# Altium project 520电机驱动模块工程.PrjPcb
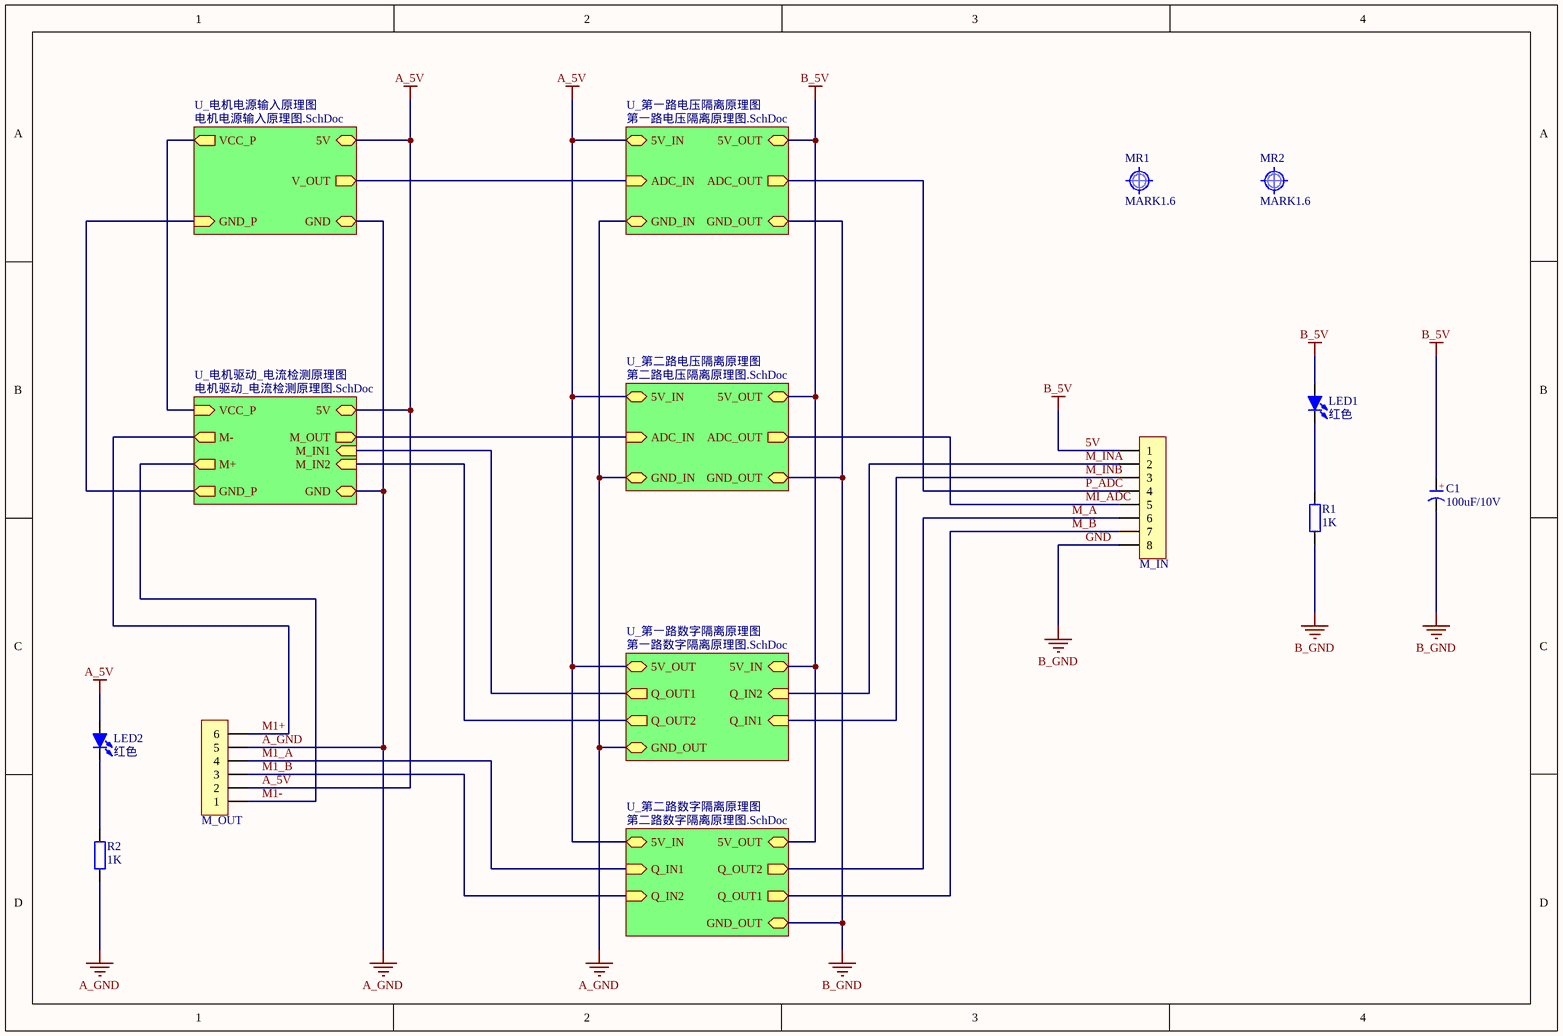
[diagram p0: 总原理框图.SchDoc]
6 sheets, 68 parts. Net scope: hierarchical (ports join the sheet entries above them; power ports are global).
Board file: PCB.PcbDoc
Sheets:
  总原理框图.SchDoc
    U_电机电源输入原理图 = 电机电源输入原理图.SchDoc
    U_第一路数字隔离原理图 = 第一路数字隔离原理图.SchDoc
    U_第一路电压隔离原理图 = 第一路电压隔离原理图.SchDoc
    U_第二路数字隔离原理图 = 第二路数字隔离原理图.SchDoc
    U_第二路电压隔离原理图 = 第二路电压隔离原理图.SchDoc

## Sheet 总原理框图.SchDoc
size A4

### Parts
C1  100uF/10V  [CD B(3528)]
LED1  红色  [LED 0603W]
LED2  红色  [LED 0603W]
M_IN  HDR-1X8  [ZH1.5-WI-8P]  (value not drawn)
M_OUT  HDR-1X6  [PH2.0-WI-6P]  (value not drawn)
MR1  MARK1.6  [Mark 1.6]
MR2  MARK1.6  [Mark 1.6]
R1  1K  [R 0603_M]
R2  1K  [R 0603_M]

### Sub-sheets
U_电机电源输入原理图 = 电机电源输入原理图.SchDoc: V_OUT (out), VCC_P (out), GND_P (in), 5V (bidir), GND (bidir)
U_电机驱动_电流检测原理图 = 电机驱动_电流检测原理图.SchDoc (file not in this document): 5V (bidir), VCC_P (in), GND_P (out), M+ (out), M- (out), GND (bidir), M_OUT (out), M_IN1 (in), M_IN2 (in)
U_第一路数字隔离原理图 = 第一路数字隔离原理图.SchDoc: 5V_IN (bidir), 5V_OUT (bidir), GND_OUT (bidir), Q_IN2 (in), Q_IN1 (in), Q_OUT1 (out), Q_OUT2 (out)
U_第一路电压隔离原理图 = 第一路电压隔离原理图.SchDoc: ADC_IN (in), ADC_OUT (out), 5V_IN (bidir), 5V_OUT (bidir), GND_IN (bidir), GND_OUT (bidir)
U_第二路数字隔离原理图 = 第二路数字隔离原理图.SchDoc: 5V_IN (bidir), 5V_OUT (bidir), GND_OUT (bidir), Q_IN2 (in), Q_IN1 (in), Q_OUT1 (out), Q_OUT2 (out)
U_第二路电压隔离原理图 = 第二路电压隔离原理图.SchDoc: ADC_IN (in), ADC_OUT (out), 5V_IN (bidir), 5V_OUT (bidir), GND_IN (bidir), GND_OUT (bidir)

### Nets
5V: C1.1(A) LED1.1(A) M_IN.1 ; sheet U_第一路数字隔离原理图/5V_IN, sheet U_第一路电压隔离原理图/5V_OUT, sheet U_第二路数字隔离原理图/5V_OUT, sheet U_第二路电压隔离原理图/5V_OUT  [also labelled B_5V]
A_5V: LED2.1(A) M_OUT.2 ; sheet U_电机电源输入原理图/5V, sheet U_电机驱动_电流检测原理图/5V, sheet U_第一路数字隔离原理图/5V_OUT, sheet U_第一路电压隔离原理图/5V_IN, sheet U_第二路数字隔离原理图/5V_IN, sheet U_第二路电压隔离原理图/5V_IN
A_GND: M_OUT.5 R2.1 ; sheet U_电机电源输入原理图/GND, sheet U_电机驱动_电流检测原理图/GND, sheet U_第一路数字隔离原理图/GND_OUT, sheet U_第一路电压隔离原理图/GND_IN, sheet U_第二路电压隔离原理图/GND_IN
GND: C1.2(K) M_IN.8 R1.1 ; sheet U_第一路电压隔离原理图/GND_OUT, sheet U_第二路数字隔离原理图/GND_OUT, sheet U_第二路电压隔离原理图/GND_OUT  [also labelled B_GND]
M1+: M_OUT.6 ; sheet U_电机驱动_电流检测原理图/M-
M1-: M_OUT.1 ; sheet U_电机驱动_电流检测原理图/M+
M1_A: M_OUT.4 ; sheet U_第二路数字隔离原理图/Q_IN1
M1_B: M_OUT.3 ; sheet U_第二路数字隔离原理图/Q_IN2
M_A: M_IN.6 ; sheet U_第二路数字隔离原理图/Q_OUT2
M_B: M_IN.7 ; sheet U_第二路数字隔离原理图/Q_OUT1
M_INA: M_IN.2 ; sheet U_第一路数字隔离原理图/Q_IN2
M_INB: M_IN.3 ; sheet U_第一路数字隔离原理图/Q_IN1
MI_ADC: M_IN.5 ; sheet U_第二路电压隔离原理图/ADC_OUT
P_ADC: M_IN.4 ; sheet U_第一路电压隔离原理图/ADC_OUT
NetC3_1: sheet U_电机电源输入原理图/VCC_P, sheet U_电机驱动_电流检测原理图/VCC_P
NetC3_2: sheet U_电机电源输入原理图/GND_P, sheet U_电机驱动_电流检测原理图/GND_P
NetLED1_2: LED1.2(K) R1.2
NetLED2_2: LED2.2(K) R2.2
NetR3_1: sheet U_电机电源输入原理图/V_OUT, sheet U_第一路电压隔离原理图/ADC_IN
NetR8_1: sheet U_电机驱动_电流检测原理图/M_IN1, sheet U_第一路数字隔离原理图/Q_OUT1
NetR9_1: sheet U_电机驱动_电流检测原理图/M_IN2, sheet U_第一路数字隔离原理图/Q_OUT2
NetR21_1: sheet U_电机驱动_电流检测原理图/M_OUT, sheet U_第二路电压隔离原理图/ADC_IN

### Notes on the sheet
- (in symbol C-CD) +

### Library data of the parts
C1 = C-CD: 贴片钽电容; 版权归属: 源创客; BOM名称: 贴片钽电容; 学习资源: www.ooocke.com
LED1 LED2 = LED-SMD: 贴片LED; 版权归属: 源创客; BOM名称: 贴片LED; 学习资源: www.ooocke.com
M_IN = Header 8: 8P接插件; 版权归属: 源创客; BOM名称: 8P接插件; 学习资源: www.ooocke.com
M_OUT = Header 6: 6P接插件; 版权归属: 源创客; BOM名称: 6P接插件; 学习资源: www.ooocke.com
MR1 MR2 = MARK: 光学定位点; 版权归属: 源创客; BOM名称: 光学定位点; 学习资源: www.ooocke.com
R1 R2 = R: 贴片电阻; 版权归属: 源创客; BOM名称: 贴片电阻; 学习资源: www.ooocke.com

## Sheet 电机电源输入原理图.SchDoc
size A4
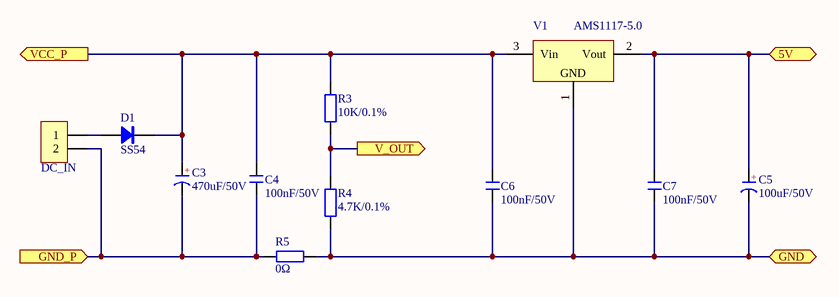
[diagram p1: 电机电源输入原理图.SchDoc]

### Parts
C3  470uF/50V  [CAP 5.0*12.5*20]
C4  100nF/50V  [C 0603_M]
C5  100uF/50V  [CAP 3.5*8*11.5]
C6  100nF/50V  [C 0603_M]
C7  100nF/50V  [C 0603_M]
D1  SS54  [SMA]
DC_IN  HDR-1X2  [XT30PW-M公头]  (value not drawn)
R3  10K/0.1%  [R 0603_M]
R4  4.7K/0.1%  [R 0603_M]
R5  0Ω  [R 0805_M]
V1  AMS1117-5.0  [SOT89_N]

### Ports
5V (bidir), GND (bidir), GND_P (in), V_OUT (out), VCC_P (out)

### Nets
A_5V: C5.1(A) C7.2 V1.2(Vout) ; port 5V
A_GND: C5.2(K) C6.1 C7.1 R4.1 R5.1 V1.1(GND) ; port GND
NetC3_1: C3.1(A) C4.2 C6.2 D1.2(K) R3.2 V1.3(Vin) ; port VCC_P
NetC3_2: C3.2(K) C4.1 DC_IN.2 R5.2 ; port GND_P
NetD1_1: D1.1(A) DC_IN.1
NetR3_1: R3.1 R4.2 ; port V_OUT

### Notes on the sheet
- (in symbol C-CAP) +

### Library data of the parts
C3 C5 = C-CAP: 直插电解电容; 版权归属: 源创客; BOM名称: 直插电解电容; 学习资源: www.ooocke.com
C4 C6 C7 = C: 无极性贴片电容; 版权归属: 源创客; 材质: X7R; BOM名称: 无极性贴片电容; 学习资源: www.ooocke.com
D1 = SS24: 肖特基二极管; 版权归属: 源创客; 属性: 40V/2A; BOM名称: 肖特基二极管; 学习资源: www.ooocke.com
DC_IN = Header 2: 2P接插件; 版权归属: 源创客; BOM名称: 2P接插件; 学习资源: www.ooocke.com
R3-R5 = R: 贴片电阻; 版权归属: 源创客; BOM名称: 贴片电阻; 学习资源: www.ooocke.com
V1 = AMS1117: 三端稳压芯片; BOM名称: 稳压芯片; 版权归属: 源创客; 学习资源: www.ooocke.com

## Sheet 第一路数字隔离原理图.SchDoc
size A4
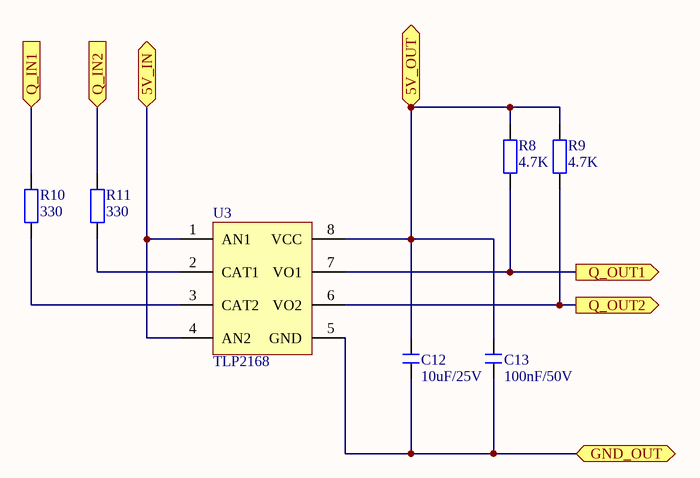
[diagram p2: 第一路数字隔离原理图.SchDoc]

### Parts
C12  10uF/25V  [C 0603_M]
C13  100nF/50V  [C 0603_M]
R8  4.7K  [R 0603_M]
R9  4.7K  [R 0603_M]
R10  330  [R 0603_M]
R11  330  [R 0603_M]
U3  TLP2168  [SOP8_N]

### Ports
5V_IN (bidir), 5V_OUT (bidir), GND_OUT (bidir), Q_IN1 (in), Q_IN2 (in), Q_OUT1 (out), Q_OUT2 (out)

### Nets
5V: U3.1(AN1) U3.4(AN2) ; port 5V_IN
A_5V: C12.1 C13.2 R8.2 R9.2 U3.8(VCC) ; port 5V_OUT
A_GND: C12.2 C13.1 U3.5(GND) ; port GND_OUT
M_INA: R11.2 ; port Q_IN2
M_INB: R10.2 ; port Q_IN1
NetR8_1: R8.1 U3.7(VO1) ; port Q_OUT1
NetR9_1: R9.1 U3.6(VO2) ; port Q_OUT2
NetR10_1: R10.1 U3.3(CAT2)
NetR11_1: R11.1 U3.2(CAT1)

### Library data of the parts
C12 C13 = C: 无极性贴片电容; 版权归属: 源创客; 材质: X7R; BOM名称: 无极性贴片电容; 学习资源: www.ooocke.com
R8-R11 = R: 贴片电阻; 版权归属: 源创客; BOM名称: 贴片电阻; 学习资源: www.ooocke.com
U3 = TLP2168: 高速双通道隔离光耦

## Sheet 第一路电压隔离原理图.SchDoc
size A4
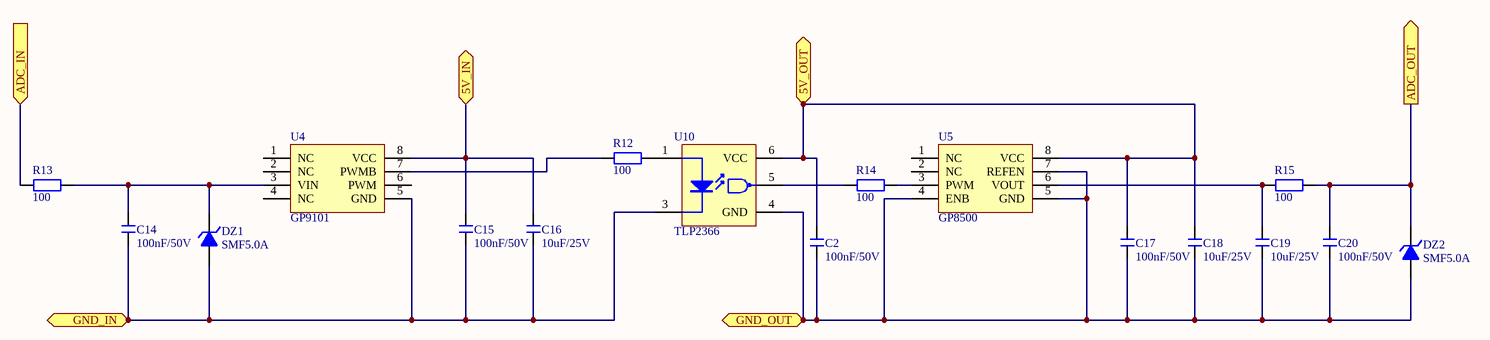
[diagram p3: 第一路电压隔离原理图.SchDoc]

### Parts
C2  100nF/50V  [C 0603_M]
C14  100nF/50V  [C 0603_M]
C15  100nF/50V  [C 0603_M]
C16  10uF/25V  [C 0603_M]
C17  100nF/50V  [C 0603_M]
C18  10uF/25V  [C 0603_M]
C19  10uF/25V  [C 0603_M]
C20  100nF/50V  [C 0603_M]
DZ1  SMF5.0A  [SOD-123]
DZ2  SMF5.0A  [SOD-123]
R12  100  [R 0603_M]
R13  100  [R 0603_M]
R14  100  [R 0603_M]
R15  100  [R 0603_M]
U4  GP9101  [SOP8_N]
U5  GP8500  [SOP8_N]
U10  TLP2366  [SOP5_N]

### Ports
5V_IN (bidir), 5V_OUT (bidir), ADC_IN (in), ADC_OUT (out), GND_IN (bidir), GND_OUT (bidir)

### Nets
5V: C2.2 C17.2 C18.2 U5.8(VCC) U10.6(VCC) ; port 5V_OUT
A_5V: C15.2 C16.2 U4.8(VCC) ; port 5V_IN
A_GND: C14.1 C15.1 C16.1 DZ1.1(A) U4.5(GND) U10.3(LED-) ; port GND_IN
GND: C2.1 C17.1 C18.1 C19.1 C20.1 DZ2.1(A) U5.4(ENB) U5.5(GND) U5.7(REFEN) U10.4(GND) ; port GND_OUT
P_ADC: C20.2 DZ2.2(K) R15.2 ; port ADC_OUT
NetC14_2: C14.2 DZ1.2(K) R13.2 U4.3(VIN)
NetC19_2: C19.2 R15.1 U5.6(VOUT)
NetR3_1: R13.1 ; port ADC_IN
NetR12_1: R12.1 U4.7(PWMB)
NetR12_2: R12.2 U10.1(LED+)
NetR14_1: R14.1 U10.5(GND)
NetR14_2: R14.2 U5.3(PWM)

Not connected (* = marked no-connect by the designer): U4 1(NC) 2(NC) 4(NC) 6(PWM); U5 1(NC) 2(NC)

### Library data of the parts
C2 C14-C20 = C: 无极性贴片电容; 版权归属: 源创客; 材质: X7R; BOM名称: 无极性贴片电容; 学习资源: www.ooocke.com
DZ1 DZ2 = 1N4620: 3.3V/0.5W稳压管; 版权归属: 源创客; BOM名称: 3.3V/0.5W稳压管; 学习资源: www.ooocke.com
R12-R15 = R: 贴片电阻; 版权归属: 源创客; BOM名称: 贴片电阻; 学习资源: www.ooocke.com
U4 = GP9101: 将0V到VCC的模拟电压输入，线性转换成0%-100%占  空比的PWM信号输出
U5 = GP8500: 0%-100% PWM 转 0-2.5V/0-VCC
U10 = TLP2366: 单路高速光耦

## Sheet 第二路数字隔离原理图.SchDoc
size A4
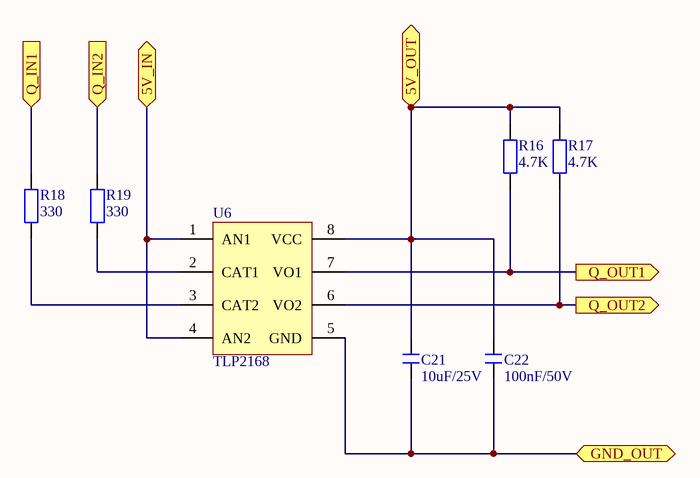
[diagram p4: 第二路数字隔离原理图.SchDoc]

### Parts
C21  10uF/25V  [C 0603_M]
C22  100nF/50V  [C 0603_M]
R16  4.7K  [R 0603_M]
R17  4.7K  [R 0603_M]
R18  330  [R 0603_M]
R19  330  [R 0603_M]
U6  TLP2168  [SOP8_N]

### Ports
5V_IN (bidir), 5V_OUT (bidir), GND_OUT (bidir), Q_IN1 (in), Q_IN2 (in), Q_OUT1 (out), Q_OUT2 (out)

### Nets
5V: C21.1 C22.2 R16.2 R17.2 U6.8(VCC) ; port 5V_OUT
A_5V: U6.1(AN1) U6.4(AN2) ; port 5V_IN
GND: C21.2 C22.1 U6.5(GND) ; port GND_OUT
M1_A: R18.2 ; port Q_IN1
M1_B: R19.2 ; port Q_IN2
M_A: R17.1 U6.6(VO2) ; port Q_OUT2
M_B: R16.1 U6.7(VO1) ; port Q_OUT1
NetR18_1: R18.1 U6.3(CAT2)
NetR19_1: R19.1 U6.2(CAT1)

### Library data of the parts
C21 C22 = C: 无极性贴片电容; 版权归属: 源创客; 材质: X7R; BOM名称: 无极性贴片电容; 学习资源: www.ooocke.com
R16-R19 = R: 贴片电阻; 版权归属: 源创客; BOM名称: 贴片电阻; 学习资源: www.ooocke.com
U6 = TLP2168: 高速双通道隔离光耦

## Sheet 第二路电压隔离原理图.SchDoc
size A4
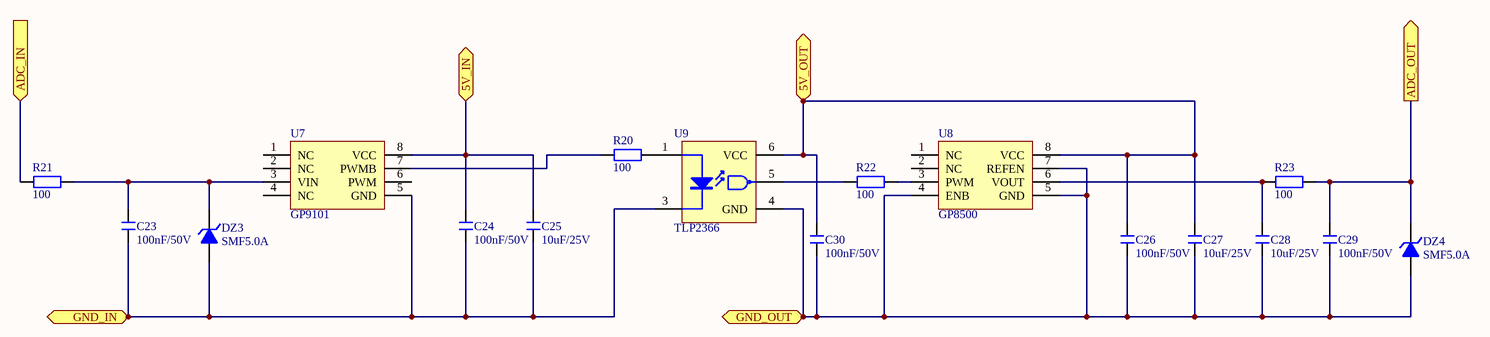
[diagram p5: 第二路电压隔离原理图.SchDoc]

### Parts
C23  100nF/50V  [C 0603_M]
C24  100nF/50V  [C 0603_M]
C25  10uF/25V  [C 0603_M]
C26  100nF/50V  [C 0603_M]
C27  10uF/25V  [C 0603_M]
C28  10uF/25V  [C 0603_M]
C29  100nF/50V  [C 0603_M]
C30  100nF/50V  [C 0603_M]
DZ3  SMF5.0A  [SOD-123]
DZ4  SMF5.0A  [SOD-123]
R20  100  [R 0603_M]
R21  100  [R 0603_M]
R22  100  [R 0603_M]
R23  100  [R 0603_M]
U7  GP9101  [SOP8_N]
U8  GP8500  [SOP8_N]
U9  TLP2366  [SOP5_N]

### Ports
5V_IN (bidir), 5V_OUT (bidir), ADC_IN (in), ADC_OUT (out), GND_IN (bidir), GND_OUT (bidir)

### Nets
5V: C26.2 C27.2 C30.2 U8.8(VCC) U9.6(VCC) ; port 5V_OUT
A_5V: C24.2 C25.2 U7.8(VCC) ; port 5V_IN
A_GND: C23.1 C24.1 C25.1 DZ3.1(A) U7.5(GND) U9.3(LED-) ; port GND_IN
GND: C26.1 C27.1 C28.1 C29.1 C30.1 DZ4.1(A) U8.4(ENB) U8.5(GND) U8.7(REFEN) U9.4(GND) ; port GND_OUT
MI_ADC: C29.2 DZ4.2(K) R23.2 ; port ADC_OUT
NetC23_2: C23.2 DZ3.2(K) R21.2 U7.3(VIN)
NetC28_2: C28.2 R23.1 U8.6(VOUT)
NetR20_1: R20.1 U7.7(PWMB)
NetR20_2: R20.2 U9.1(LED+)
NetR21_1: R21.1 ; port ADC_IN
NetR22_1: R22.1 U9.5(GND)
NetR22_2: R22.2 U8.3(PWM)

Not connected (* = marked no-connect by the designer): U7 1(NC) 2(NC) 4(NC) 6(PWM); U8 1(NC) 2(NC)

### Library data of the parts
C23-C30 = C: 无极性贴片电容; 版权归属: 源创客; 材质: X7R; BOM名称: 无极性贴片电容; 学习资源: www.ooocke.com
DZ3 DZ4 = 1N4620: 3.3V/0.5W稳压管; 版权归属: 源创客; BOM名称: 3.3V/0.5W稳压管; 学习资源: www.ooocke.com
R20-R23 = R: 贴片电阻; 版权归属: 源创客; BOM名称: 贴片电阻; 学习资源: www.ooocke.com
U7 = GP9101: 将0V到VCC的模拟电压输入，线性转换成0%-100%占  空比的PWM信号输出
U8 = GP8500: 0%-100% PWM 转 0-2.5V/0-VCC
U9 = TLP2366: 单路高速光耦

## Nets that join several sheets
5V: 总原理框图 (C1.1 LED1.1 M_IN.1), 第一路数字隔离原理图 (U3.1 U3.4), 第一路电压隔离原理图 (5 pins), 第二路数字隔离原理图 (5 pins), 第二路电压隔离原理图 (5 pins)
A_5V: 总原理框图 (LED2.1 M_OUT.2), 电机电源输入原理图 (C5.1 C7.2 V1.2), 第一路数字隔离原理图 (5 pins), 第一路电压隔离原理图 (C15.2 C16.2 U4.8), 第二路数字隔离原理图 (U6.1 U6.4), 第二路电压隔离原理图 (C24.2 C25.2 U7.8)
A_GND: 总原理框图 (M_OUT.5 R2.1), 电机电源输入原理图 (6 pins), 第一路数字隔离原理图 (C12.2 C13.1 U3.5), 第一路电压隔离原理图 (6 pins), 第二路电压隔离原理图 (6 pins)
GND: 总原理框图 (C1.2 M_IN.8 R1.1), 第一路电压隔离原理图 (10 pins), 第二路数字隔离原理图 (C21.2 C22.1 U6.5), 第二路电压隔离原理图 (10 pins)
M1_A: 总原理框图 (M_OUT.4), 第二路数字隔离原理图 (R18.2)
M1_B: 总原理框图 (M_OUT.3), 第二路数字隔离原理图 (R19.2)
M_A: 总原理框图 (M_IN.6), 第二路数字隔离原理图 (R17.1 U6.6)
M_B: 总原理框图 (M_IN.7), 第二路数字隔离原理图 (R16.1 U6.7)
M_INA: 总原理框图 (M_IN.2), 第一路数字隔离原理图 (R11.2)
M_INB: 总原理框图 (M_IN.3), 第一路数字隔离原理图 (R10.2)
MI_ADC: 总原理框图 (M_IN.5), 第二路电压隔离原理图 (C29.2 DZ4.2 R23.2)
NetR3_1: 电机电源输入原理图 (R3.1 R4.2), 第一路电压隔离原理图 (R13.1)
P_ADC: 总原理框图 (M_IN.4), 第一路电压隔离原理图 (C20.2 DZ2.2 R15.2)